# Altium schematic sheet BNO055_module.SchDoc
size A4
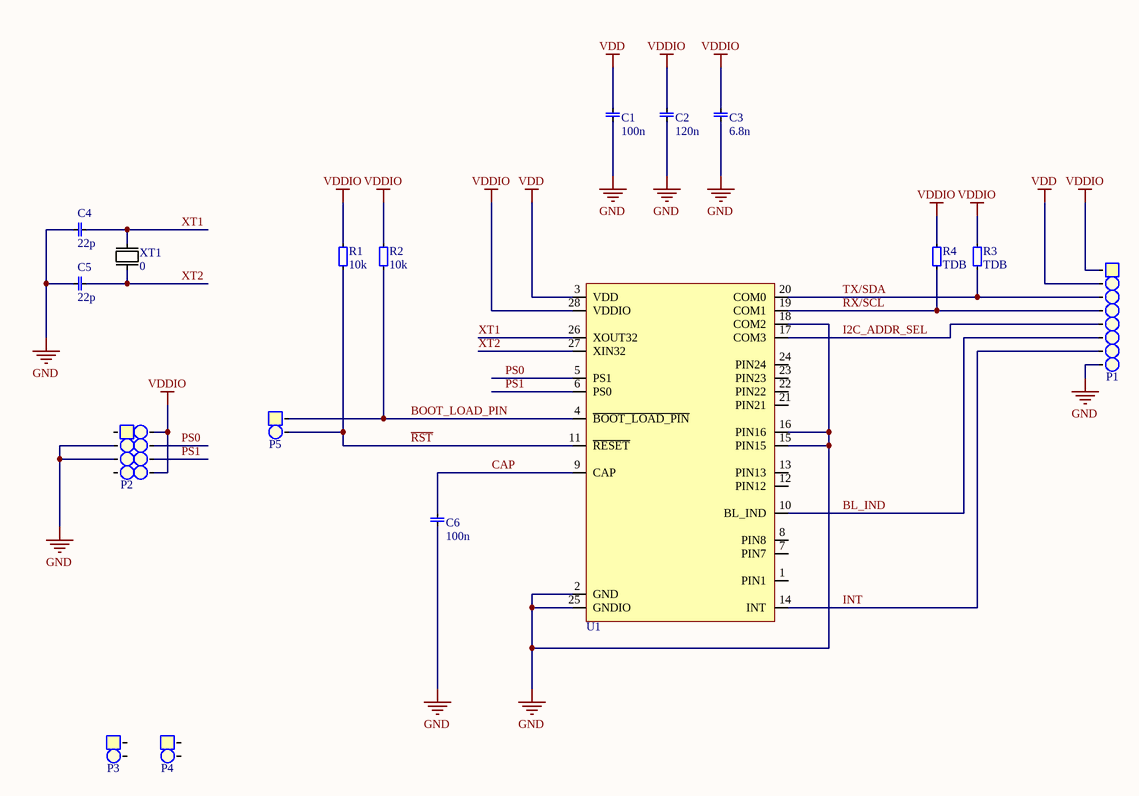
[diagram p0: BNO055_module.SchDoc]

## Parts
C1  value 100n  [0603 cap]  (hidden comment: 0603, capacitor)
C2  value 120n  [0603 cap]  (hidden comment: 0603, capacitor)
C3  value 6.8n  [0603 cap]  (hidden comment: 0603, capacitor)
C4  value 22p  [0603 cap]  (hidden comment: 0603, capacitor)
C5  value 22p  [0603 cap]  (hidden comment: 0603, capacitor)
C6  value 100n  [0603 cap]  (hidden comment: 0603, capacitor)
P1  1x8 Pin Header  [1x8 Pin HEader]  (value not drawn)
P2  2x4 Pin Header  [2X4 PH]  (value not drawn)
P3  1x2 Pin Header  [padtwo_L]  (value not drawn)
P4  1x2 Pin Header  [padtwo_L]  (value not drawn)
P5  1x2 Pin Header  [padtwo_L]  (value not drawn)
R1  value 10k  [0603]  (hidden comment: 0603, resistor)
R2  value 10k  [0603]  (hidden comment: 0603, resistor)
R3  value TDB  [0603]  (hidden comment: 0603, resistor)
R4  value TDB  [0603]  (hidden comment: 0603, resistor)
U1  BNO055  [BNO055]  (value not drawn)
XT1  value 0  [XTAL_SMD_LP]  (hidden comment: XTAL TXC 7A)

## Nets
GND: C1.0 C2.0 C3.0 C4.0 C5.0 C6.0 P1.8 P2.2 P2.3 U1.2(GND) U1.15(PIN15) U1.16(PIN16) U1.18(COM2) U1.25(GNDIO)
VDD: C1.1 P1.2 U1.3(VDD)
VDDIO: C2.1 C3.1 P1.1 P2.5 P2.8 R1.0 R2.0 R3.0 R4.0 U1.28(VDDIO)
BL_IND: P1.6 U1.10(BL_IND)
BOOT_LOAD_PIN: P5.1 R2.1 U1.4(~{BOOT_LOAD_PIN})
CAP: C6.1 U1.9(CAP)
I2C_ADDR_SEL: P1.5 U1.17(COM3)
INT: P1.7 U1.14(INT)
PS0: P2.7 U1.5(PS1)
PS1: P2.6 U1.6(PS0)
~{RST}: P5.2 R1.1 U1.11(~{RESET})
RX/SCL: P1.4 R4.1 U1.19(COM1)
TX/SDA: P1.3 R3.1 U1.20(COM0)
XT1: C4.1 U1.26(XOUT32) XT1.2
XT2: C5.1 U1.27(XIN32) XT1.1

Not connected (* = marked no-connect by the designer): P2 1 4; P3 1 2; P4 1 2; U1 1(PIN1) 7(PIN7) 8(PIN8) 12(PIN12) 13(PIN13) 21(PIN21) 22(PIN22) 23(PIN23) 24(PIN24)

## Library data of the parts
P1 = 1x8 Pin Header: 2.54 mm; Value: 1x8 Pin Header
P2 = 2x4 Pin Header: 2.54mm,; Value: 2x8 Pin Header, 2.54mm, SMD
P3-P5 = 1x2 Pin Header: 2.54 mm, TH; Value: 1x2 Pin Header
U1 = BNO055: Accelerometer, gyroskop, magnetometer, 9 axis Sensor I²C, UART Output; Value: 9 axis IMU; Digikey: *
XT1 = XTAL TXC 7A: 16 MHz, SMD, 5mm x 3,2mm, 30 ppm; Farnell: 1841946